# Altium schematic sheet Buck Converter.SchDoc
size A4; SheetNumber: 1; SheetTotal: 1
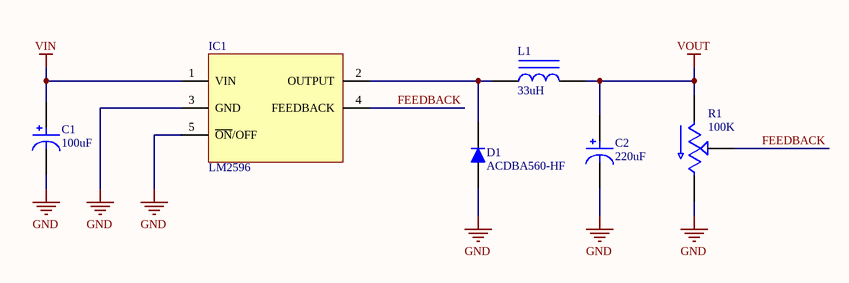
[diagram p0: Buck Converter.SchDoc]

## Parts
C1  100uF  [RADIAL-2]
C2  220uF  [RADIAL-2]
D1  ACDBA560-HF  [DO-214]
IC1  LM2596  [D2PAK]
L1  33uH  [SRR-1280]
R1  100K  [3292W]

## Nets
GND: C1.2 C2.2 D1.1 IC1.3(GND) IC1.5(~{ON}/OFF) R1.3
VIN: C1.1 IC1.1(VIN)
VOUT: C2.1 L1.2 R1.1
FEEDBACK: IC1.4(FEEDBACK) R1.2
NetD1_2: D1.2 IC1.2(OUTPUT) L1.1